# EAGLE design Adapter_UARTSPI_RS485 (EAGLE 7.5.0)
AUTHOR: Wendel; PROJECT_NAME: Adapter_UARTSPI_RS485; VERSION: Version 1.0

## Sheet 1 of 2
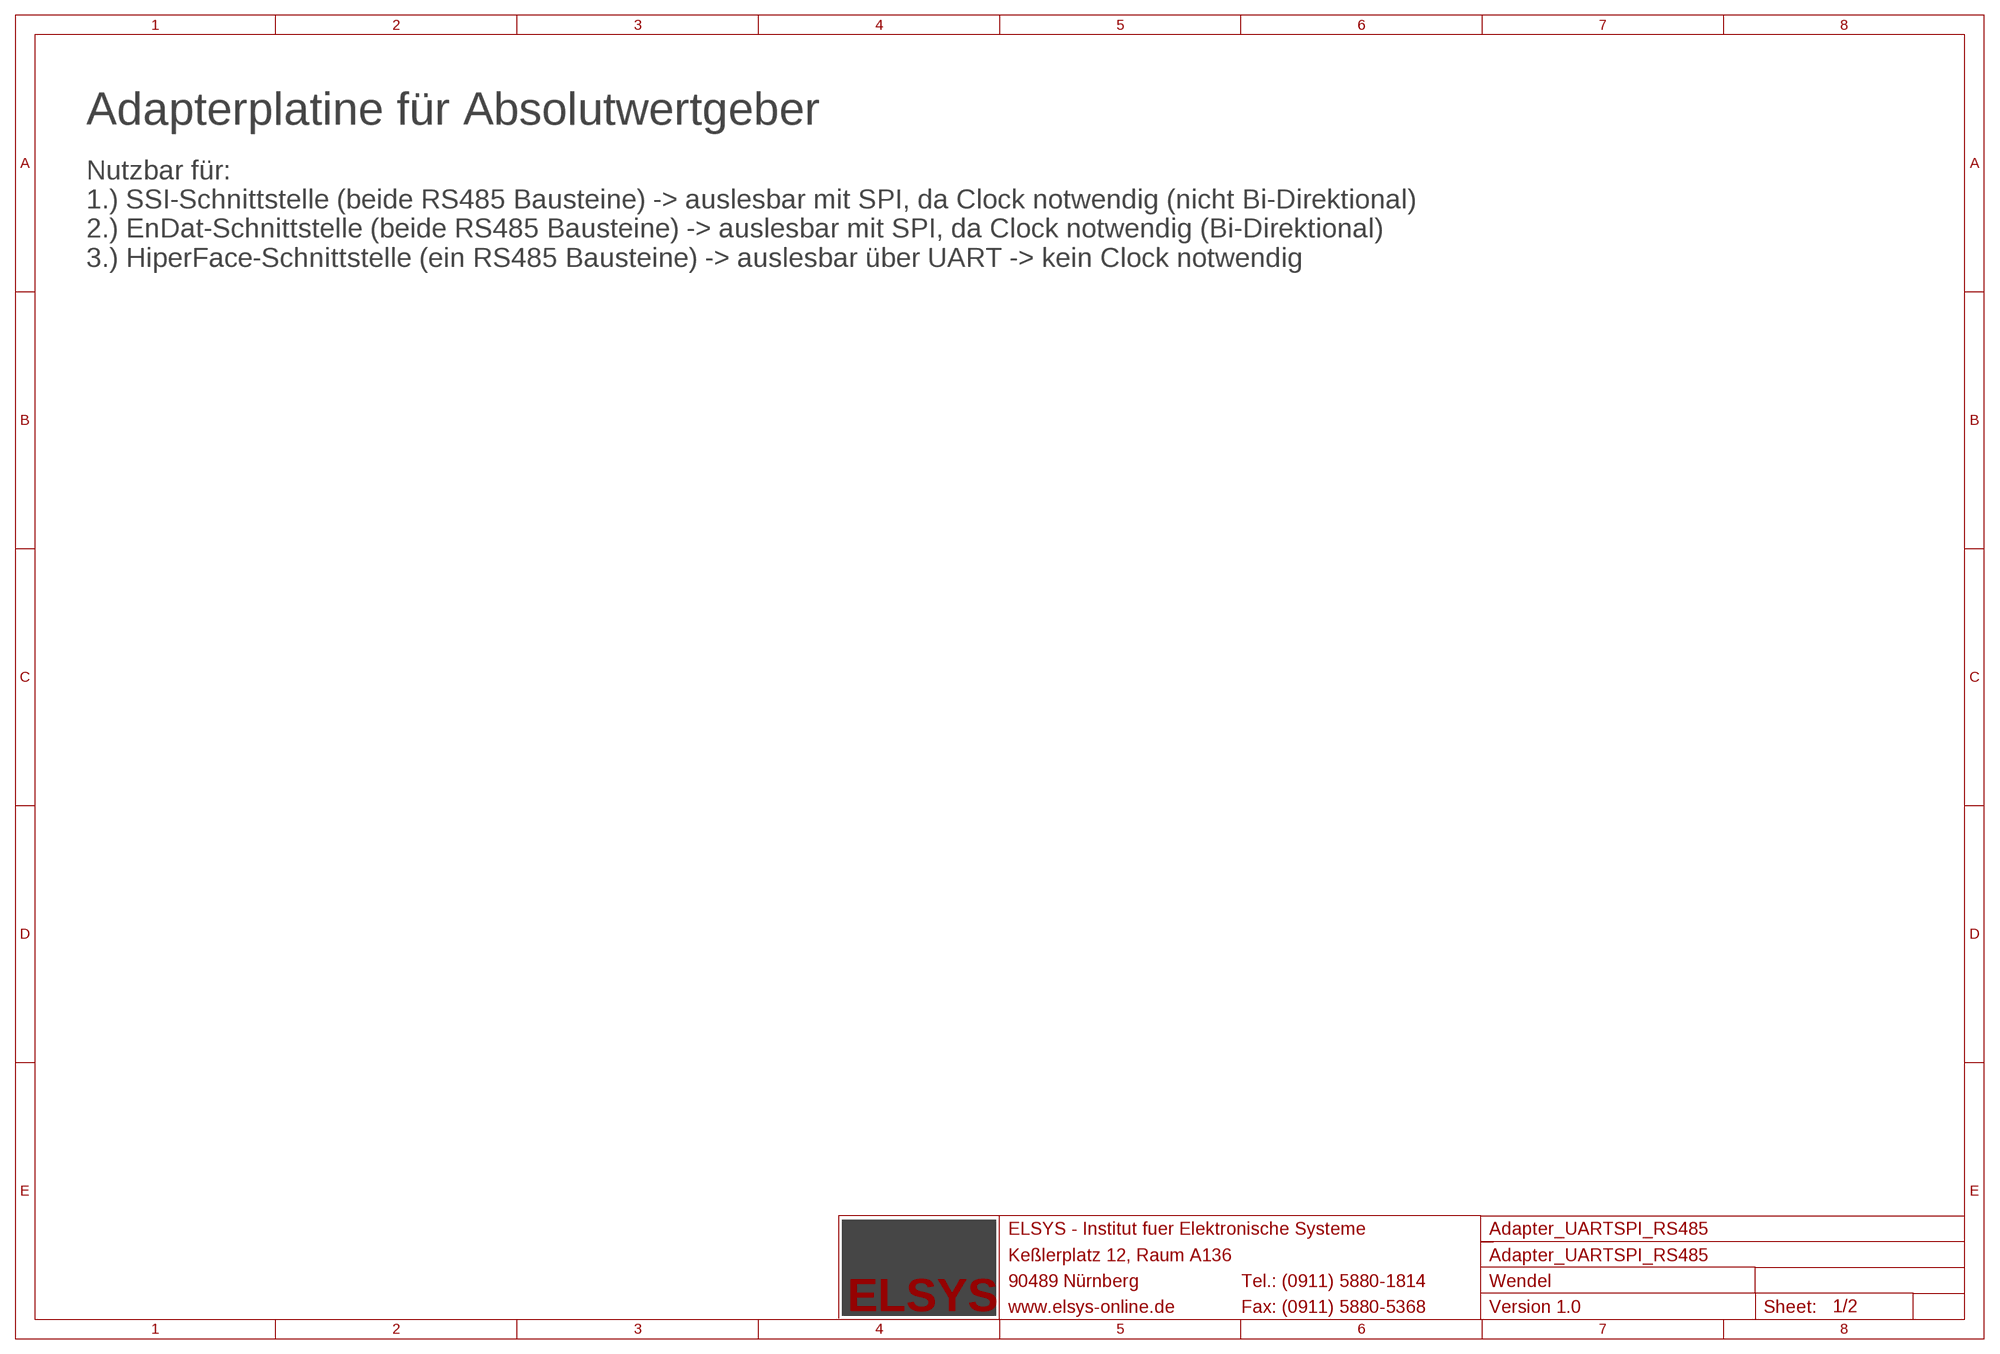
[diagram p0: schematic, sheet 1]

### Notes on the sheet
- Adapterplatine für Absolutwertgeber
- Nutzbar für:
  1.) SSI-Schnittstelle (beide RS485 Bausteine) -> auslesbar mit SPI, da Clock notwendig (nicht Bi-Direktional)
  2.) EnDat-Schnittstelle (beide RS485 Bausteine) -> auslesbar mit SPI, da Clock notwendig (Bi-Direktional)
  3.) HiperFace-Schnittstelle (ein RS485 Bausteine) -> auslesbar über UART -> kein Clock notwendig

## Sheet 2 of 2: Schnittstellen
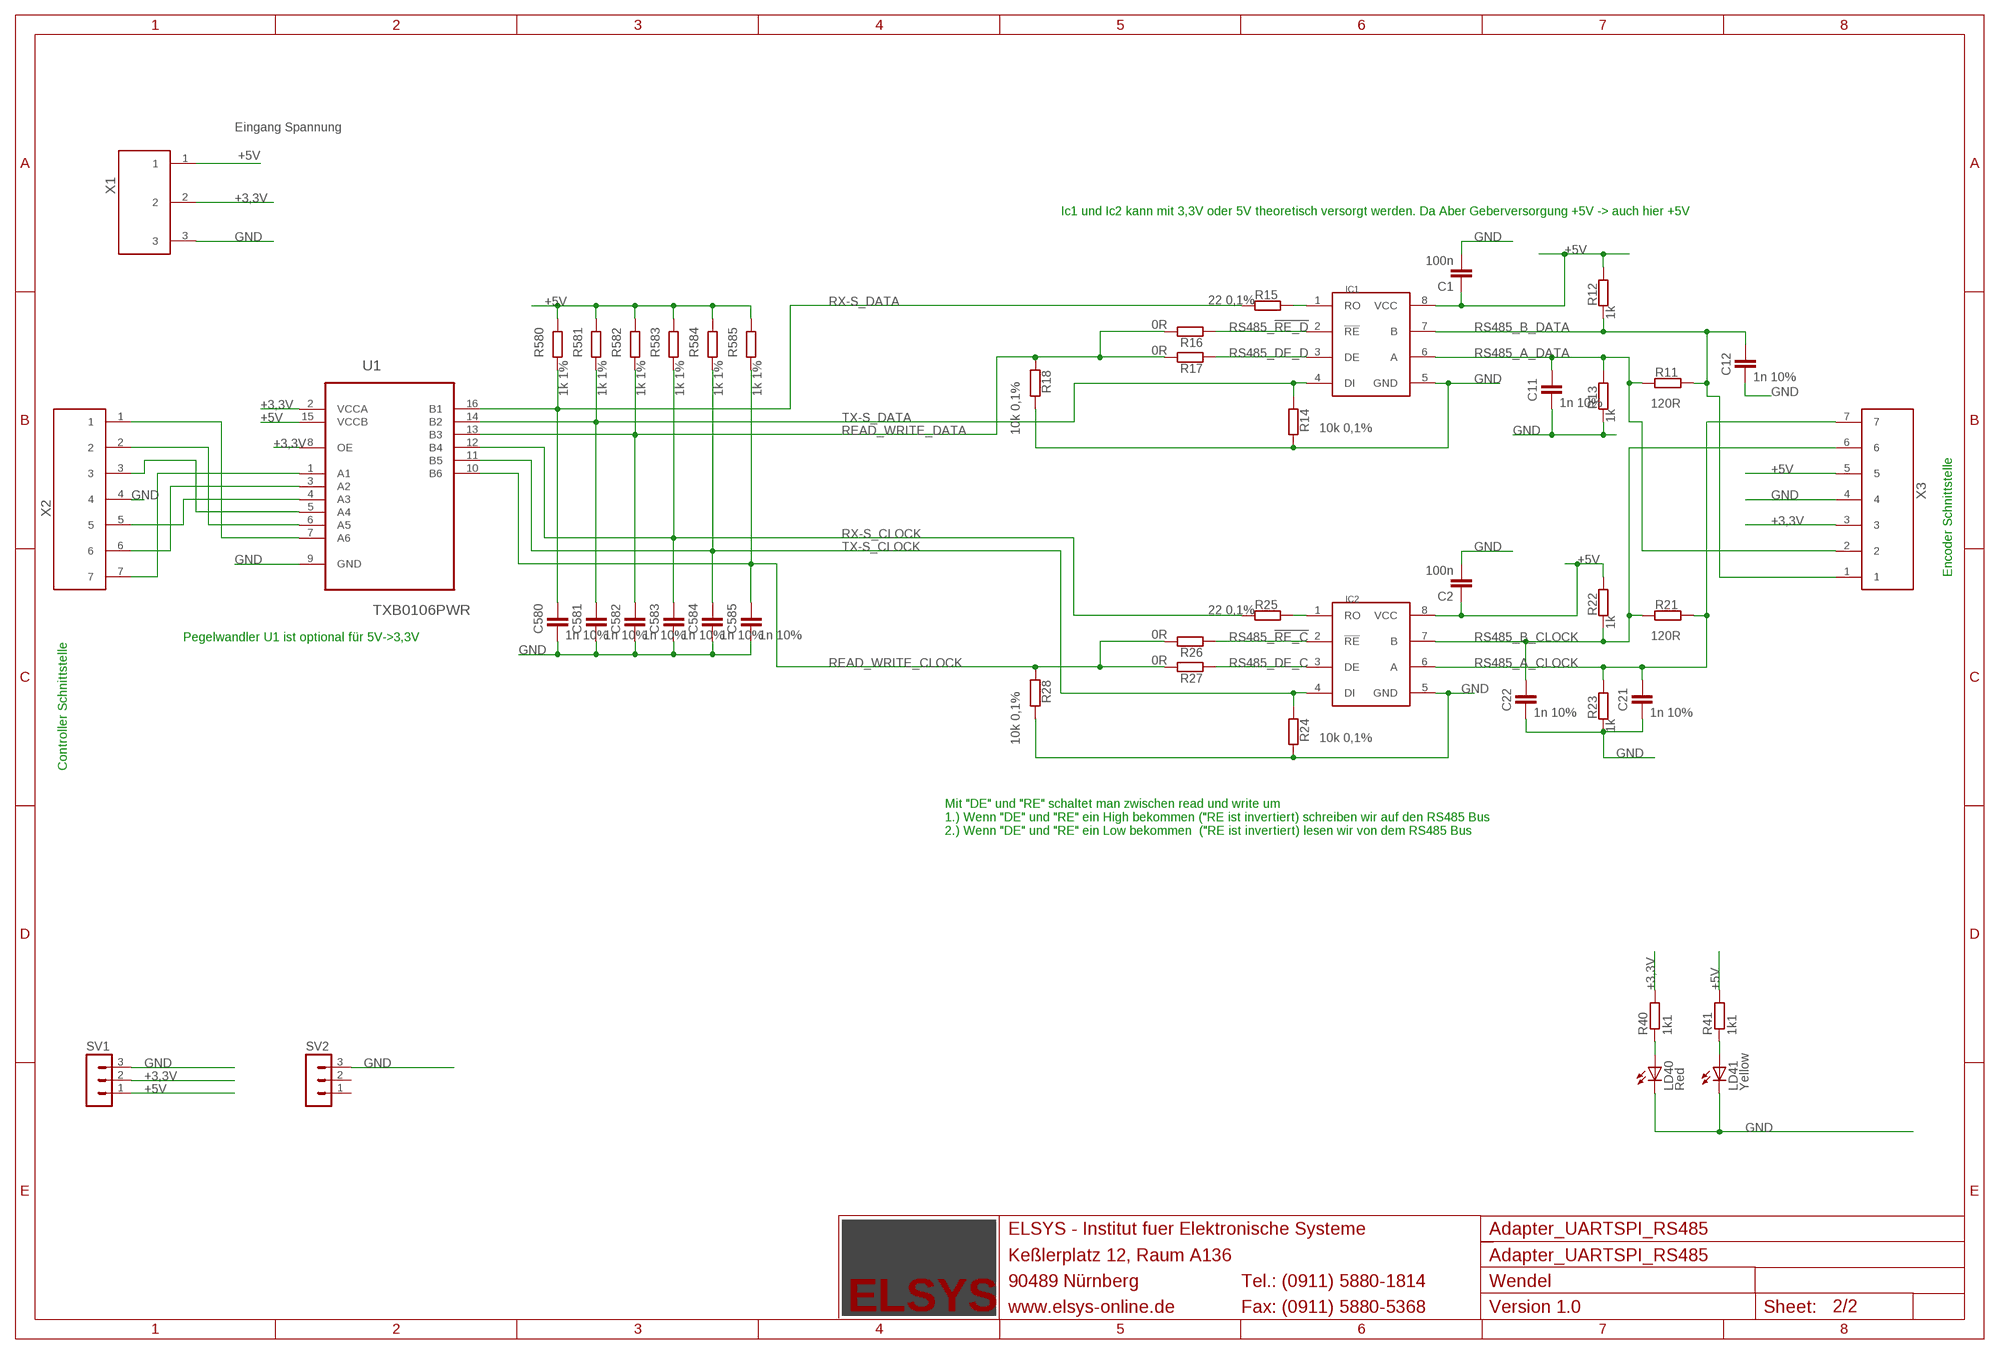
[diagram p1: schematic, sheet 2]

### Parts
C1  100n  C-EU0603  [SMD-0603]
C2  100n  C-EU0603  [SMD-0603]
C11  1n 10%  C-EU0603  [SMD-0603]
C12  1n 10%  C-EU0603  [SMD-0603]
C21  1n 10%  C-EU0603  [SMD-0603]
C22  1n 10%  C-EU0603  [SMD-0603]
C580  1n 10%  C-EU0603  [SMD-0603]
C581  1n 10%  C-EU0603  [SMD-0603]
C582  1n 10%  C-EU0603  [SMD-0603]
C583  1n 10%  C-EU0603  [SMD-0603]
C584  1n 10%  C-EU0603  [SMD-0603]
C585  1n 10%  C-EU0603  [SMD-0603]
IC1  RS485-MAXIM  [SOIC8]
IC2  RS485-MAXIM  [SOIC8]
LD40  Red  LEDCHIP-LED0805  [CHIP-LED0805]
LD41  Yellow  LEDCHIP-LED0805  [CHIP-LED0805]
R11  120R  R-EU_R0603  [R0603]
R12  1k  R-EU_R0603  [R0603]
R13  1k  R-EU_R0603  [R0603]
R14  10k 0,1%  R-EU_R0603  [R0603]
R15  22 0,1%  R-EU_R0603  [R0603]
R16  0R  R-EU_R0603  [R0603]
R17  0R  R-EU_R0603  [R0603]
R18  10k 0,1%  R-EU_R0603  [R0603]
R21  120R  R-EU_R0603  [R0603]
R22  1k  R-EU_R0603  [R0603]
R23  1k  R-EU_R0603  [R0603]
R24  10k 0,1%  R-EU_R0603  [R0603]
R25  22 0,1%  R-EU_R0603  [R0603]
R26  0R  R-EU_R0603  [R0603]
R27  0R  R-EU_R0603  [R0603]
R28  10k 0,1%  R-EU_R0603  [R0603]
R40  1k1  R-EU_R0805  [R0805]
R41  1k1  R-EU_R0805  [R0805]
R580  1k 1%  R-EU_R0603  [R0603]
R581  1k 1%  R-EU_R0603  [R0603]
R582  1k 1%  R-EU_R0603  [R0603]
R583  1k 1%  R-EU_R0603  [R0603]
R584  1k 1%  R-EU_R0603  [R0603]
R585  1k 1%  R-EU_R0603  [R0603]
SV1  MA03-1  [MA03-1]
SV2  MA03-1  [MA03-1]
U1  TXB0106PWR  [SOP65P640X120-16N]
X1  KLEMME_3POLIG_2,54  [KLEMME_3POLIG_2,54]
X2  KLEMME_7POLIG_2,54  [KLEMME_7POLIG_2,54]
X3  KLEMME_7POLIG_2,54  [KLEMME_7POLIG_2,54]

### Nets
+3,3V: R40.2 SV1.2 U1.2(VCCA) U1.8(OE) X1.2 X3.3
+5V: C1.1 C2.1 IC1.8(VCC) IC2.8(VCC) R12.1 R22.1 R41.2 R580.2 R581.2 R582.2 R583.2 R584.2 R585.2 SV1.1 U1.15(VCCB) X1.1 X3.5
GND: C1.2 C2.2 C11.2 C12.2 C21.2 C22.2 C580.2 C581.2 C582.2 C583.2 C584.2 C585.2 IC1.5(GND) IC2.5(GND) LD40.C LD41.C R13.2 R14.1 R18.1 R23.2 R24.1 R28.1 SV1.3 SV2.3 U1.9(GND) X1.3 X2.4 X3.4
N$1: IC2.1(RO) R25.1
N$2: LD41.A R41.1
N$3: LD40.A R40.1
N$10: IC1.1(RO) R15.1
R/W_CLOCK: U1.7(A6) X2.1
R/W_DATA: U1.4(A3) X2.5
READ_WRITE_CLOCK: C585.1 R26.1 R27.1 R28.2 R585.1 U1.10(B6)
READ_WRITE_DATA: C582.1 R16.1 R17.1 R18.2 R582.1 U1.13(B3)
RS485_!RE_C: IC2.2(!RE) R26.2
RS485_!RE_D: IC1.2(!RE) R16.2
RS485_A_CLOCK: C21.1 IC2.6(A) R21.1 R23.1 X3.7
RS485_A_DATA: C11.1 IC1.6(A) R11.2 R13.1 X3.2
RS485_B_CLOCK: C22.1 IC2.7(B) R21.2 R22.2 X3.6
RS485_B_DATA: C12.1 IC1.7(B) R11.1 R12.2 X3.1
RS485_DE_C: IC2.3(DE) R27.2
RS485_DE_D: IC1.3(DE) R17.2
RX-S_CLOCK: C583.1 R25.2 R583.1 U1.12(B4)
RX-S_DATA: C580.1 R15.2 R580.1 U1.16(B1)
RX_CLOCK: U1.5(A4) X2.3
RX_DATA: U1.1(A1) X2.7
TX-S_CLOCK: C584.1 IC2.4(DI) R24.2 R584.1 U1.11(B5)
TX-S_DATA: C581.1 IC1.4(DI) R14.2 R581.1 U1.14(B2)
TX_CLOCK: U1.6(A5) X2.2
TX_DATA: U1.3(A2) X2.6
Unconnected: SV2.1 SV2.2

### Notes on the sheet
- Eingang Spannung
- Ic1 und Ic2 kann mit 3,3V oder 5V theoretisch versorgt werden. Da Aber Geberversorgung +5V -> auch hier +5V
- Encoder Schnittstelle
- Pegelwandler U1 ist optional für 5V->3,3V
- Controller Schnittstelle
- Mit "DE" und "RE" schaltet man zwischen read und write um
  1.) Wenn "DE" und "RE" ein High bekommen ("RE ist invertiert) schreiben wir auf den RS485 Bus
  2.) Wenn "DE" und "RE" ein Low bekommen  ("RE ist invertiert) lesen wir von dem RS485 Bus

## Library data of the parts
C1 C2 C11 C12 C21 C22 C580-C585 = Elsys - Kondenstatoren:C-EU: CAPACITOR, European symbol
IC1 IC2 = ELSYS - Symetrierung:RS485-MAXIM
LD40 LD41 = led (2):LED: LED OSRAM: - CHIPLED LG R971, LG N971, LY N971, LG Q971, LY Q971, LO R971, LY R971 LH N974, LH R974 LS Q976, LO Q976, LY Q976 LO Q996 - Hyper CHIPLED LW Q18S LB Q993, LB Q99A, LB R99A - SideLED LS A670, LO A670, LY A670, LG A670, LP A670 LB A673, LV A673, LT A673, LW A673 LH A674 LY A675 LS A676, LA A676, LO A676, LY A676, LW A676 LS A679, LY A679, LG A679 - Hyper Micro SIDELED® LS Y876, LA Y876, LO Y876, LY Y876 LT Y87S - SmartLED LW L88C, LW L88S LB L89C, LB L89S, LG L890 LS L89K, LO L89K, LY L89K LS L896, LA L896, LO L896, LY L896 - TOPLED LS T670, LO T670, LY T670, LG T670, LP T670 LSG T670, LSP T670, LSY T670, LOP T670, LYG T670 LG T671, LOG T671, LSG T671 LB T673, LV T673, LT T673, LW T673 LH T674 LS T676, LA T676, LO T676, LY T676, LB T676, LH T676, LSB T676, LW T676 LB T67C, LV T67C, LT T67C, LS T67K, LO T67K, LY T67K, LW E67C LS E67B, LA E67B, LO E67B, LY E67B, LB E67C, LV E67C, LT E67C LW T67C LS T679, LY T679, LG T679 LS T770, LO T770, LY T770, LG T770, LP T770 LB T773, LV T773, LT T773, LW T773 LH T774 LS E675, LA E675, LY E675, LS T675 LS T776, LA T776, LO T776, LY T776, LB T776 LHGB T686 LT T68C, LB T68C - Hyper Mini TOPLED® LB M676 - Mini TOPLED Santana® LG M470 LS M47K, LO M47K, LY M47K Source: http://www.osram.convergy.de LUXEON: - LUMILED® LXK2-PW12-R00, LXK2-PW12-S00, LXK2-PW14-U00, LXK2-PW14-V00 LXK2-PM12-R00, LXK2-PM12-S00, LXK2-PM14-U00 LXK2-PE12-Q00, LXK2-PE12-R00, LXK2-PE12-S00, LXK2-PE14-T00, LXK2-PE14-U00 LXK2-PB12-K00, LXK2-PB12-L00, LXK2-PB12-M00, LXK2-PB14-N00, LXK2-PB14-P00, LXK2-PB14-Q00 LXK2-PR12-L00, LXK2-PR12-M00, LXK2-PR14-Q00, LXK2-PR14-R00 LXK2-PD12-Q00, LXK2-PD12-R00, LXK2-PD12-S00 LXK2-PH12-R00, LXK2-PH12-S00 LXK2-PL12-P00, LXK2-PL12-Q00, LXK2-PL12-R00 Source: www.luxeon.com KINGBRIGHT: KA-3528ASYC Source: www.kingbright.com
R11-R18 R21-R28 R40 R41 R580-R585 = Elsys - Widerstaende:R-EU_: RESISTOR, European symbol
SV1 SV2 = Elsys - Stiftleisten:MA03-1: PIN HEADER
U1 = Texas Instruments_By_element14_Batch_1:TXB0106PWR: VOLTAGE-LEVEL TRANSLATOR; MPN: TXB0106PWR; OC_FARNELL: 1694679; OC_NEWARK: 46P3786; PACKAGE: TSSOP-16; SUPPLIER: Texas Instruments
X1 = ELSYS - Symetrierung:KLEMME_3POLIG_2,54
X2 X3 = ELSYS - Symetrierung:KLEMME_7POLIG_2,54

## Net classes
1 power: width 0.3 mm
7 analog_power: width 0.25 mm

## Board
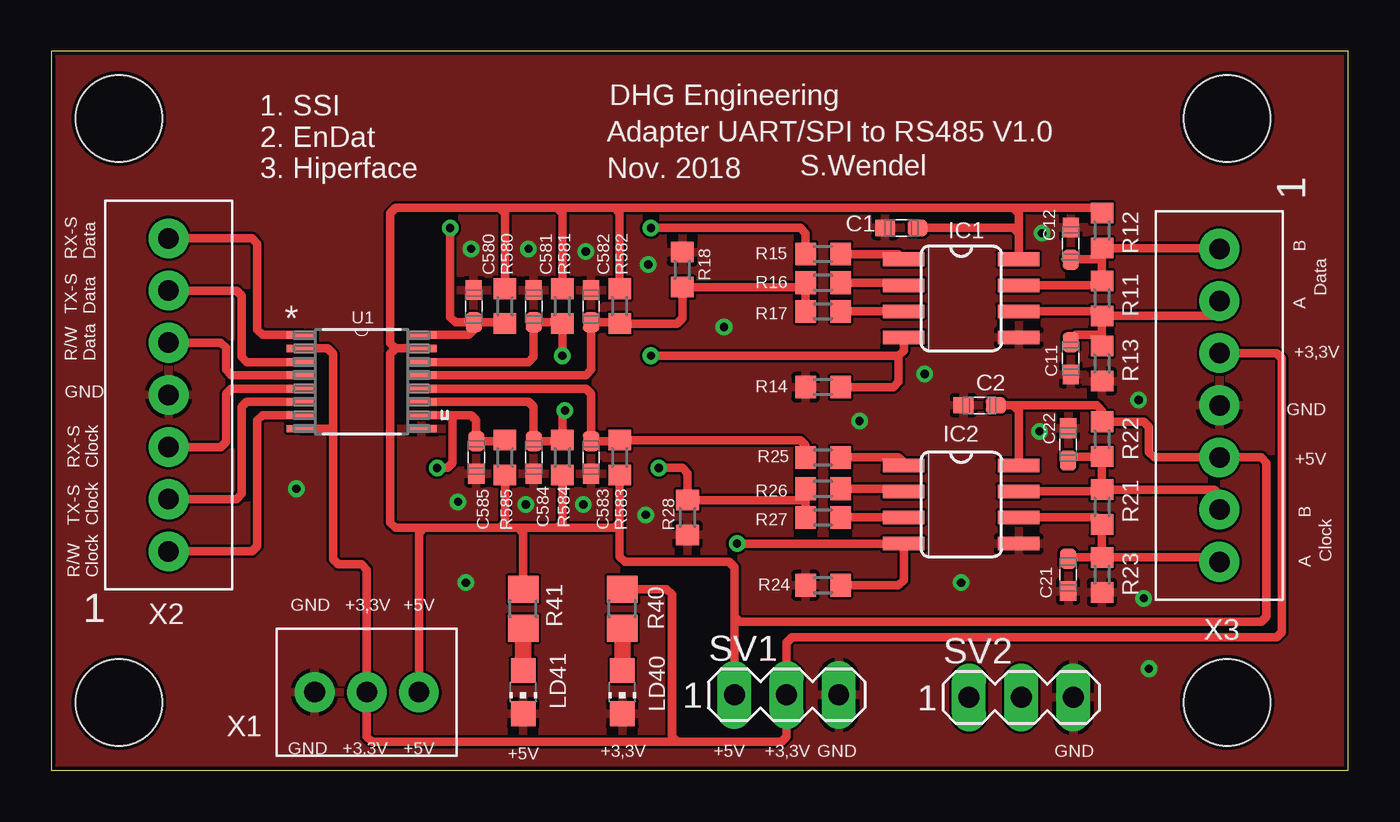
[diagram p2: board, top side]
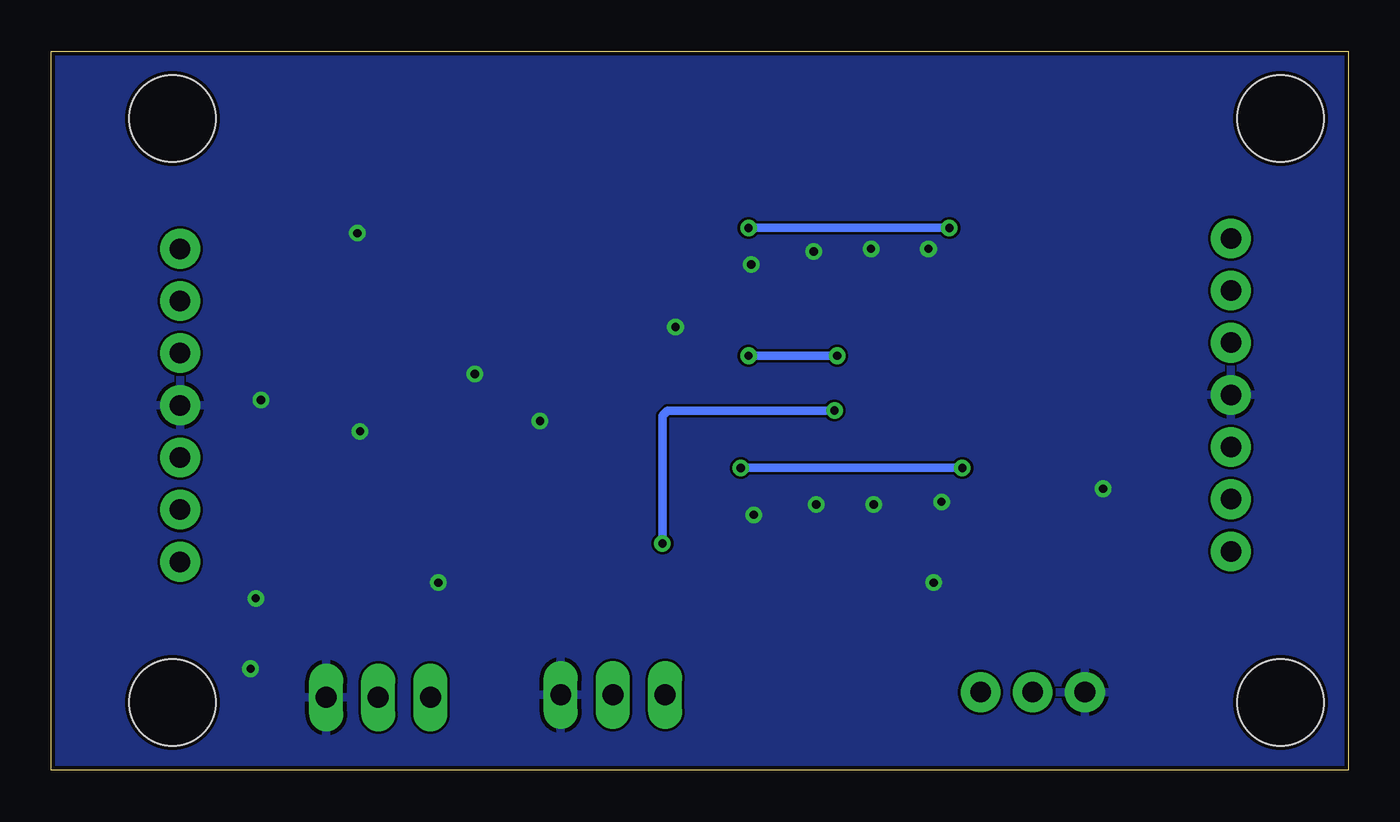
[diagram p3: board, bottom side, seen from below]

Size 63.17 x 35.02 mm. Coordinates in mm from the lower left corner, seen from the top.
Outline: 0,0 63.17,0 63.17,35.02 0,35.02 0,0
Copper layers (1+2*15+16): Top 0.035mm / dielectric 0.36mm / layer 2 0.035mm / dielectric 0.71mm / layer 15 0.035mm / dielectric 0.36mm / Bottom 0.035mm
Design rules "PCB-POOL Standard *": minimum track width 0.15mm, minimum drill 0.2mm, track to track 5mil, track to pad 5mil, pad to pad 5mil, via to via 5mil, smd to smd 5mil, copper to edge 0.2mm, drill to drill 6mil, minimum pad ring 12.5mil, minimum via ring 8mil, stop-mask expansion 0.075mm, vias tented up to drill 24mil, thermal gap 0.2mm
Holes 4.2 mm at 3.3,3.3 57.28,31.75 3.3,31.75 57.28,3.3
tKeepout: area 1.5,1.5 to 8.5,8.5

### Footprints (pad centres in the part's own frame; a part is rotated, then mirrored left to right if it is on the bottom)
SMD-0603 = smd 0.965 x 0.787: 1 -0.787,0; 2 0.787,0
SOIC8 = smd 0.66 x 2.032: 1 -1.905,-2.8; 2 -0.635,-2.8; 3 0.635,-2.8; 4 1.905,-2.8; 5 1.905,2.8; 6 0.635,2.8; 7 -0.635,2.8; 8 -1.905,2.8
CHIP-LED0805 = smd 1.2 x 1.2: A 0,-1.05; C 0,1.05
R0603 = smd 1 x 1.1: 1 -0.85,0; 2 0.85,0
R0805 = smd 1.3 x 1.5: 1 -0.95,0; 2 0.95,0
MA03-1 = drill 1.016 long: 1 -2.54,0; 2 0,0; 3 2.54,0
SOP65P640X120-16N = smd 1.473 x 0.356: 1 -2.921,2.286; 2 -2.921,1.626; 3 -2.921,0.965; 4 -2.921,0.33; 5 -2.921,-0.33; 6 -2.921,-0.965; 7 -2.921,-1.626; 8 -2.921,-2.286; 9 2.921,-2.286; 10 2.921,-1.626; 11 2.921,-0.965; 12 2.921,-0.33; 13 2.921,0.33; 14 2.921,0.965; 15 2.921,1.626; 16 2.921,2.286
KLEMME_3POLIG_2,54 = drill 1 pad 1.93: 1 -2.54,0; 2 0,0; 3 2.54,0
KLEMME_7POLIG_2,54 = drill 1 pad 1.93: 1 -7.62,0; 2 -5.08,0; 3 -2.54,0; 4 0,0; 5 2.54,0; 6 5.08,0; 7 7.62,0

### Placement (x,y rotation side)
C1  41.4,26.42 180 top
C2  45.21,17.78 180 top
C11  49.66,20.07 270 top
C12  49.66,25.65 90 top
C21  49.53,9.53 270 top
C22  49.53,15.88 90 top
C580  20.57,22.61 90 top
C581  23.5,22.61 90 top
C582  26.29,22.61 90 top
C583  26.29,15.24 270 top
C584  23.5,15.24 270 top
C585  20.7,15.24 270 top
IC1  44.32,22.99 270 top
IC2  44.32,12.95 270 top
LD40  27.81,3.81 180 top
LD41  22.99,3.81 180 top
R11  51.18,22.99 270 top
R12  51.18,26.29 270 top
R13  51.18,19.81 270 top
R14  37.59,18.67 0 top
R15  37.59,25.15 180 top
R16  37.59,23.75 0 top
R17  37.59,22.35 0 top
R18  30.73,24.38 270 top
R21  51.18,12.83 90 top
R22  51.18,16.13 270 top
R23  51.18,9.53 270 top
R24  37.59,9.02 0 top
R25  37.59,15.24 180 top
R26  37.59,13.72 0 top
R27  37.59,12.32 0 top
R28  30.99,12.32 90 top
R40  27.81,7.87 90 top
R41  22.99,7.87 90 top
R580  22.1,22.61 90 top
R581  24.89,22.61 90 top
R582  27.69,22.61 90 top
R583  27.69,15.24 270 top
R584  24.89,15.24 270 top
R585  22.1,15.24 270 top
SV1  35.81,3.68 0 top
SV2  47.24,3.56 0 top
U1  15.11,18.92 0 top
X1  15.37,3.81 180 top
X2  5.71,18.29 90 top
X3  56.9,17.78 270 top

### Tracks (layer width: path | path; a pad name or v marks a point on that pad's centre or on a via)
+3,3V
  Top 0.406: X3.3 59.69,20.32 59.94,20.07 59.94,6.73 59.69,6.48 36.07,6.48 35.81,6.22 SV1.2 35.81,1.65 35.56,1.4 30.48,1.4 | 30.48,1.4 30.23,1.65 30.23,8.57 29.97,8.82 R40.2 | 30.48,1.4 15.62,1.4 15.37,1.65 X1.2 15.37,9.78 15.11,10.03 13.97,10.03 13.72,10.29 13.72,14.48 13.72,16.38 | 13.72,16.38 13.72,20.3 13.46,20.55 U1.2 | U1.8 13.46,16.64 13.72,16.38
+5V
  Top 0.406: 16.76,20.55 16.51,20.8 16.51,27.14 16.76,27.39 21.84,27.39 | 21.84,27.39 24.64,27.39 | 24.64,27.39 27.43,27.39 | R580.2 22.1,27.14 21.84,27.39 | R581.2 24.89,27.14 24.64,27.39 | R582.2 27.69,27.14 27.43,27.39 | X1.1 17.91,11.56 18.16,11.81 | 18.16,11.81 21.84,11.81 | 22.73,11.81 24.64,11.81 | 24.64,11.81 27.43,11.81 27.69,12.06 | R41.2 22.99,11.56 22.73,11.81 | 22.73,11.81 21.84,11.81 | R585.2 22.1,12.06 21.84,11.81 | R584.2 24.89,12.06 24.64,11.81 | R583.2 27.69,12.06 | R12.1 51.05,27.39 46.87,27.39 | 46.87,27.39 27.43,27.39 | 46.87,27.39 47.12,27.14 IC1.8 47.12,26.16 46.87,26.42 C1.1 | IC2.8 47.12,17.53 46.87,17.78 | SV1.1 33.27,7.49 | 33.27,7.49 33.27,9.91 33.02,10.16 27.94,10.16 27.69,10.41 27.69,12.06 | 33.27,7.49 33.53,7.24 58.93,7.24 59.18,7.49 59.18,14.99 58.93,15.24 X3.5 53.72,15.24 53.47,15.49 53.47,16.73 53.21,16.98 R22.1 51.18,17.53 50.93,17.78 46.87,17.78 | 46.87,17.78 C2.1 | U1.15 16.76,20.55 | 16.76,20.55 16.51,20.3 16.51,12.06 16.76,11.81 18.16,11.81
GND  (via drill 0.4)
  other vias: 11.94,13.72 32.77,21.59 29.08,24.64 42.55,19.3 39.37,17.02 44.32,9.14 53.47,4.95 52.96,18.03 20.19,9.14 19.81,13.08 28.96,12.45 26.04,25.27 23.11,12.95 25.91,12.95 23.24,25.4 20.45,25.4 48.26,26.16 48.13,16.51 53.21,8.38
  pour Top: 0,0 63.12,0 63.12,34.92 0,34.92
  pour Bottom: 0,0 63.12,0 63.12,34.92 0,34.92
N$1
  Top 0.406: IC2.1 41.52,14.99 41.27,15.24 R25.1
N$2
  Top 0.813: R41.1 LD41.A
N$3
  Top 0.813: R40.1 LD40.A
N$10
  Top 0.406: IC1.1 41.27,25.15 R15.1
R/W_CLOCK
  Top 0.406: U1.7 10.29,17.3 10.03,17.04 10.03,10.92 9.78,10.67 X2.1
R/W_DATA
  Top 0.406: U1.4 8.76,19.25 8.51,19.51 8.51,20.57 8.26,20.83 X2.5
READ_WRITE_CLOCK  (via drill 0.4)
  Top 0.15: C585.1 20.77,16.09
  Top 0.406: R585.1 22.04,16.03 C585.1 20.7,17.04 20.45,17.3 19.56,17.3 | 19.56,17.3 U1.10 | R27.1 R26.1 36.74,13.42 36.49,13.17 R28.2 30.99,14.48 30.73,14.73 v29.59,14.73 | v18.8,14.73 19.3,14.73 19.56,14.99 19.56,17.3
  Bottom 0.406: v29.59,14.73 v18.8,14.73
READ_WRITE_DATA
  Top 0.15: 26.35,21.76 C582.1
  Top 0.406: U1.13 26.04,19.25 26.29,19.51 C582.1 27.62,21.82 R582.1 30.48,21.76 30.73,22.01 R18.2 36.53,23.53 R16.1 R17.1
RS485_!RE_C
  Top 0.406: IC2.2 41.4,13.72 R26.2
RS485_!RE_D
  Top 0.406: IC1.2 41.4,23.75 R16.2
RS485_A_CLOCK
  Top 0.406: X3.7 56.68,10.38 R23.1 | R23.1 R21.1 50.93,12.32 IC2.6 | C21.1 49.59,10.38 R23.1
RS485_A_DATA
  Top 0.406: X3.2 56.9,22.39 56.64,22.14 R11.2 | R11.2 51.18,21.21 | 51.18,21.21 R13.1 | R11.2 50.97,22.35 IC1.6 | C11.1 49.66,20.95 49.91,21.21 51.18,21.21
RS485_B_CLOCK
  Top 0.406: 51.14,15.24 arc90 R22.2 | X3.6 56.9,13.42 56.64,13.68 R21.2 | R21.2 R22.2 | R21.2 51.09,13.59 IC2.7 | C22.1 49.72,15.28 R22.2
RS485_B_DATA
  Top 0.406: X3.1 56.86,25.44 R12.2 51.18,24.89 | 51.18,24.89 R11.1 50.97,23.62 IC1.7 | C12.1 49.63,24.89 | 49.63,24.89 49.4,24.89 | 49.63,24.89 51.18,24.89
RS485_DE_C
  Top 0.406: IC2.3 R27.2
RS485_DE_D
  Top 0.406: IC1.3 R17.2
RX-S_CLOCK
  Top 0.15: C583.1 26.35,16.09
  Top 0.406: U1.12 26.04,18.59 26.29,18.34 C583.1 27.62,16.03 R583.1 36.49,16.09 36.74,15.84 R25.2
RX-S_DATA  (via drill 0.4)
  Top 0.406: R580.1 22.04,21.82 21.08,21.82 C580.1 | C580.1 20.57,21.46 20.32,21.21 U1.16 | R15.2 36.74,26.16 36.49,26.42 v29.21,26.42 | v19.43,26.42 19.43,22.07 19.68,21.82 C580.1
  Bottom 0.406: v29.21,26.42 v19.43,26.42
RX_CLOCK
  Top 0.406: U1.5 8.76,18.59 8.51,18.34 8.51,16 8.26,15.75 X2.3
RX_DATA
  Top 0.406: U1.1 10.29,21.21 10.03,21.46 10.03,25.65 9.78,25.91 X2.7
TX-S_CLOCK  (via drill 0.4)
  Top 0.406: U1.11 23.24,17.96 23.5,17.7 C584.1 24.83,16.03 R584.1 24.89,17.4 v25.02,17.53 | v33.4,11.05 IC2.4 41.52,9.27 41.27,9.02 R24.2
  Bottom 0.406: v33.4,11.05 33.4,17.27 33.15,17.53 v25.02,17.53
TX-S_DATA  (via drill 0.4)
  Top 0.15: 25.07,21.7 R581.1 24.83,21.82
  Top 0.406: 25.07,21.7 24.96,21.82 C581.1 23.5,20.14 23.24,19.89 U1.14 | IC1.4 41.52,20.45 41.27,20.19 | 41.27,20.19 v29.21,20.19 | v24.89,20.19 R581.1 | 41.27,20.19 41.27,18.92 41.02,18.67 R14.2
  Bottom 0.406: v29.21,20.19 v24.89,20.19
TX_CLOCK
  Top 0.406: U1.6 9.53,17.96 9.27,17.7 9.27,13.46 9.02,13.21 X2.2
TX_DATA
  Top 0.406: U1.3 9.53,19.89 9.27,20.14 9.27,23.11 9.02,23.37 X2.6

### Text on the board
tNames: DHG Engineering | Adapter UART/SPI to RS485 V1.0 | 1. SSI / 2. EnDat / 3. Hiperface | Nov. 2018 | S.Wendel | 1 | RX-S / Data | B | Data | TX-S / Data | A | +3,3V | R/W / Data | GND | GND | RX-S / Clock | +5V | TX-S / Clock | B | A | Clock | R/W / Clock | 1 | GND | +3,3V | +5V | GND | +3,3V | +5V | +5V | +3,3V | +5V | +3,3V | GND | GND